# Altium schematic sheet CaRe_Schematic_SMD_TOP_PANEL.SchDoc
size B
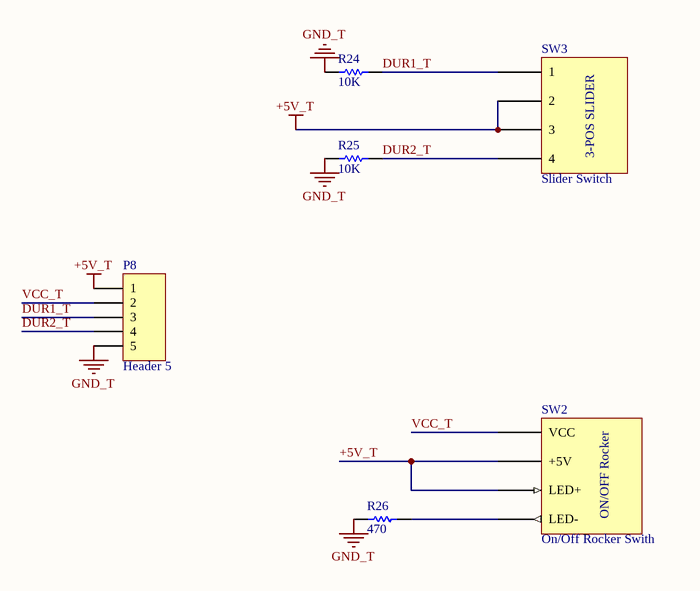
[diagram p0: CaRe_Schematic_SMD_TOP_PANEL.SchDoc]

## Parts
P8  Header 5  [HDR1X5]
R24  value 10K  [RES0805]  (hidden comment: Resistor)
R25  value 10K  [RES0805]  (hidden comment: Resistor)
R26  value 470  [RES0805]  (hidden comment: Resistor)
SW2  On/Off Rocker Swith  [Power_Switch]
SW3  Slider Switch  [SLIDER]

## Nets
+5V_T: P8.1 SW2.2(+5V) SW2.3(LED+) SW3.2 SW3.3
GND_T: P8.5 R24.1 R25.1 R26.1
DUR1_T: P8.3 R24.2 SW3.1
DUR2_T: P8.4 R25.2 SW3.4
VCC_T: P8.2 SW2.1(VCC)
NetR26_2: R26.2 SW2.4(LED-)

## Notes on the sheet
- (in symbol SLIDER) 3-POS SLIDER

## Library data of the parts
P8 = Header 5: Header, 5-Pin; LatestRevisionDate: 17-Jul-2002; LatestRevisionNote: Re-released for DXP Platform.; Publisher: Altium Limited
R24-R26 = Chip Res: Published: 8-Jun-2000; LatestRevisionDate: 17-Jul-2002; LatestRevisionNote: Re-released for DXP Platform.; PackageReference: AXIAL-0.3; Publisher: Altium Limited; PackageDescription: Axial Device, Thru-Hole; 2 Leads; 0.3 in Pin Spacing
SW2 = ON/OFF Rocker
SW3 = SLIDER